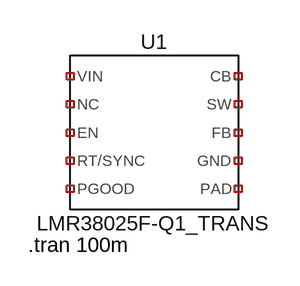
[diagram p0: schematic Draft1.asc]
Draft1.asc, the LTspice schematic file:
Version 4.1
SHEET 1 880 680
SYMBOL LMR38025F-Q1_TRANS 224 176 R0
SYMATTR InstName U1
TEXT 80 304 Left 2 !.tran 100m

The netlist it stands for:
* Draft1.asc
X§U1 NC_01 NC_02 NC_03 NC_04 NC_05 NC_06 NC_07 NC_08 NC_09 NC_10 LMR38025F-Q1_TRANS  ; pins VIN NC EN RT/SYNC PGOOD CB SW FB GND PAD
.tran 100m
.lib LMR38025F-Q1_TRANS.lib
.backanno
.end